# Altium project TP3_Ejercicio3.PrjPcb
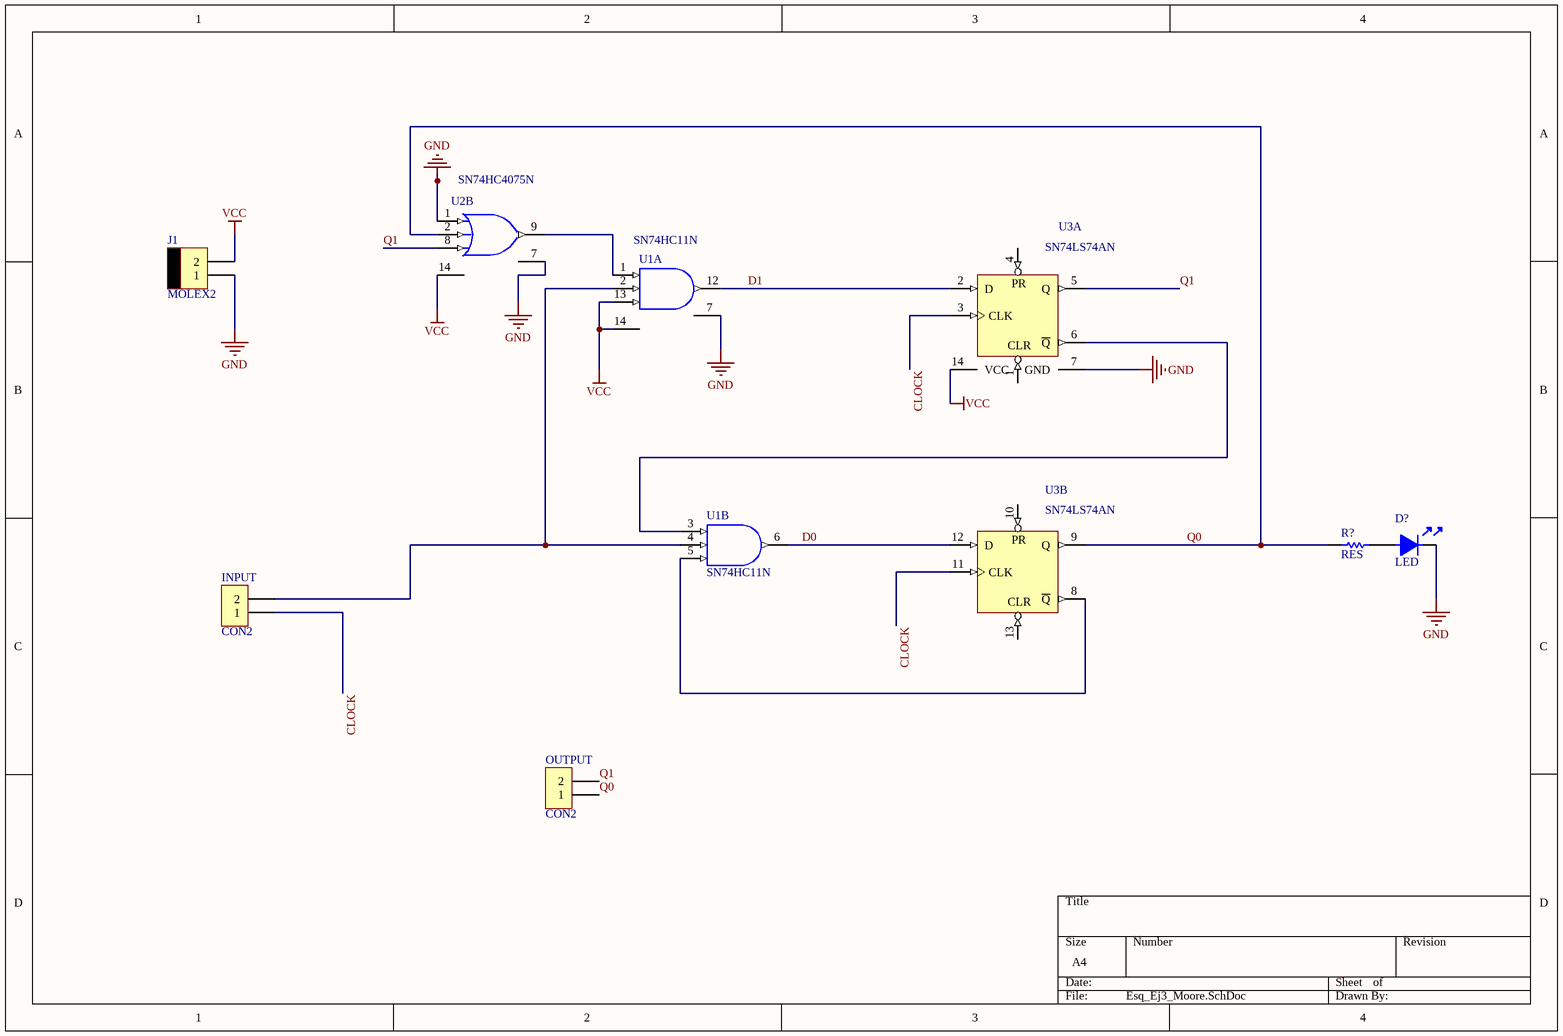
[diagram p0: Esq_Ej3_Moore.SchDoc]
2 sheets, 16 parts. Net scope: global (net labels, ports and power ports of the same name join across sheets).
Board file: PCB_Ej3.PcbDoc
Sheets:
  Esq_Ej3_Moore.SchDoc
  Esq_Ej3_Mealy.SchDoc

## Sheet Esq_Ej3_Moore.SchDoc
size A4

### Parts
(Parts that share a designator on the sheet are numbered #1, #2 ... from top to bottom, then left to right.)
D?#1  LED  [LED3]
INPUT#1  CON2  [SIP2]
J1  MOLEX2  [MOLEX2]
OUTPUT  CON2  [SIP2]
R?#1  RES  [RES400]
U1  SN74HC11N  [N014]  (parts A,B of 3)
U2  SN74HC4075N  [N014]  (part B of 3)
U3  SN74LS74AN  [N014D]  (parts A,B of 2)

### Nets
GND: D?#1.2 J1.1 U1.7(GND) U2.1(A) U2.7(GND) U3.7(GND)
VCC: J1.2 U1.13(C) U1.14(VCC) U2.14(VCC) U3.14(VCC)
CLOCK: INPUT#1.1 U3.3(CLK) U3.11(CLK)
D0: U1.6(Y) U3.12(D)
D1: U1.12(Y) U3.2(D)
Q0: OUTPUT.1 R?#1.1 U2.2(B) U3.9(Q)
Q1: OUTPUT.2 U2.8(C) U3.5(Q)
NetD?#1_1: D?#1.1 R?#1.2
NetINPUT#1_2: INPUT#1.2 U1.2(B) U1.4(B)
NetU1_1: U1.1(A) U2.9(Y)
NetU1_3: U1.3(A) U3.6(~{Q})
NetU1_5: U1.5(C) U3.8(~{Q})

Not connected (* = marked no-connect by the designer): U3 1(CLR) 4(PR) 10(PR) 13(CLR)

### Library data of the parts
U1 = SN74HC11N: Triple 3-Input Positive-AND Gate; Published: 8-Jun-2000; LatestRevisionDate: 04-Mar-2005; LatestRevisionNote: Stylized 3D Model Added.; DatasheetVersion: May-1997; PackageVersion: Oct-1995; PackageReference: N014; Publisher: Altium Limited; PackageDescription: DIP; 14 Leads; Row Spacing 7.62 mm; Pitch 2.54 mm; ComponentLink1Description: Manufacturer Link; ComponentLink1URL: http://www.ti.com/; ComponentLink2Description: Datasheet; ComponentLink2URL: http://www-s.ti.com/sc/ds/SN74HC11.pdf
U2 = SN74HC4075N: Triple 3-Input Positive-OR Gate; Published: 8-Jun-2000; LatestRevisionDate: 04-Mar-2005; LatestRevisionNote: Stylized 3D Model Added.; DatasheetVersion: Sep-1987; PackageVersion: Oct-1995; PackageReference: N014; Publisher: Altium Limited; PackageDescription: DIP; 14 Leads; Row Spacing 7.62 mm; Pitch 2.54 mm; ComponentLink1Description: Manufacturer Link; ComponentLink1URL: http://www.ti.com/; ComponentLink2Description: Datasheet; ComponentLink2URL: http://www-s.ti.com/sc/ds/sn74hc4075.pdf
U3 = SN74LS74AN: Dual D-Type Positive-Edge-Triggered Flip-Flop with Preset and Clear; Published: 8-Jun-2000; LatestRevisionDate: 04-Mar-2005; LatestRevisionNote: Stylized 3D Model Added.; DatasheetVersion: Mar-1988; PackageVersion: Oct-1995; PackageReference: N014D; Publisher: Altium Limited; PackageDescription: DIP; 14 Leads; Row Spacing 7.62 mm; Pitch 2.54 mm; ComponentLink1Description: Manufacturer Link; ComponentLink1URL: http://www.ti.com/; ComponentLink2Description: Datasheet; ComponentLink2URL: http://www-s.ti.com/sc/ds/sn74ls74a.pdf

## Sheet Esq_Ej3_Mealy.SchDoc
size A4
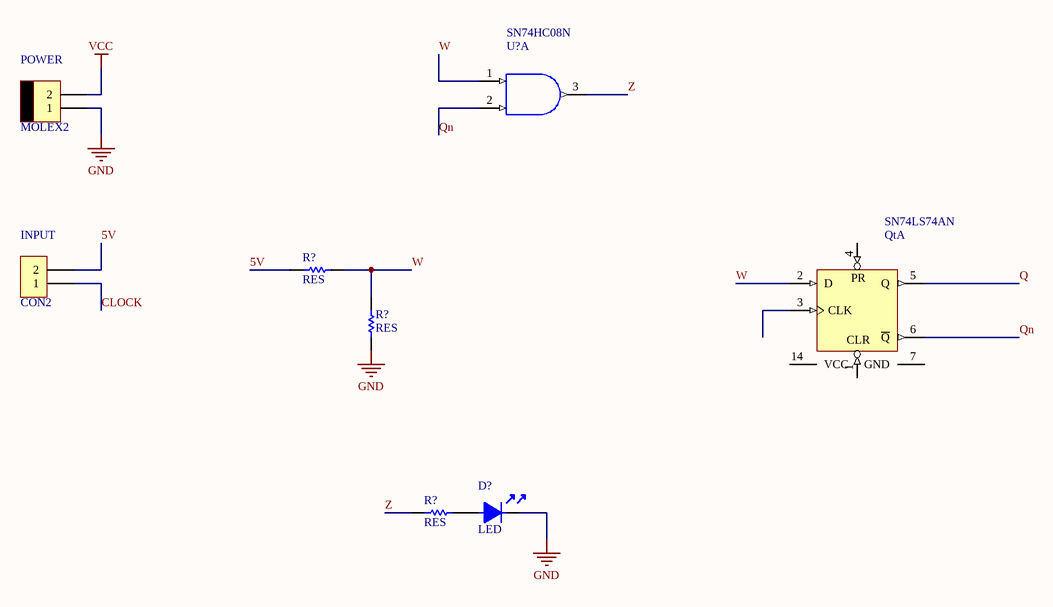
[diagram p1: Esq_Ej3_Mealy.SchDoc]

### Parts
(Parts that share a designator on the sheet are numbered #1, #2 ... from top to bottom, then left to right.)
D?#2  LED  [LED3]
INPUT#2  CON2  [SIP2]
POWER  MOLEX2  [MOLEX2]
Qt  SN74LS74AN  [N014D]  (part A of 2)
R?#2  RES  [RES400]
R?#3  RES  [RES400]
R?#4  RES  [RES400]
U?  SN74HC08N  [N014]  (part A of 4)

### Nets
GND: D?#2.2 POWER.1 R?#3.1 U?.7(GND)
VCC: POWER.2 U?.14(VCC)
5V: INPUT#2.2 R?#2.1
CLOCK: INPUT#2.1
Q: Qt.5(Q)
Qn: Qt.6(~{Q}) U?.2(B)
W: Qt.2(D) R?#2.2 R?#3.2 U?.1(A)
Z: R?#4.1 U?.3(Y)
NetD?#2_1: D?#2.1 R?#4.2

Not connected (* = marked no-connect by the designer): Qt 1(CLR) 3(CLK) 4(PR) 7(GND) 14(VCC)

### Library data of the parts
Qt = SN74LS74AN: as U3 on sheet Esq_Ej3_Moore; Published: 8-Jun-2000; LatestRevisionDate: 04-Mar-2005; LatestRevisionNote: Stylized 3D Model Added.; DatasheetVersion: Mar-1988; PackageVersion: Oct-1995; PackageReference: N014D; Publisher: Altium Limited; PackageDescription: DIP; 14 Leads; Row Spacing 7.62 mm; Pitch 2.54 mm; ComponentLink1Description: Manufacturer Link; ComponentLink1URL: http://www.ti.com/; ComponentLink2Description: Datasheet; ComponentLink2URL: http://www-s.ti.com/sc/ds/sn74ls74a.pdf
U? = SN74HC08N: Quadruple 2-Input Positive-AND Gate; Published: 8-Jun-2000; LatestRevisionDate: 04-Mar-2005; LatestRevisionNote: Stylized 3D Model Added.; DatasheetVersion: May-1997; PackageVersion: Oct-1995; PackageReference: N014; Publisher: Altium Limited; PackageDescription: DIP; 14 Leads; Row Spacing 7.62 mm; Pitch 2.54 mm; ComponentLink1Description: Manufacturer Link; ComponentLink1URL: http://www.ti.com/; ComponentLink2Description: Datasheet; ComponentLink2URL: http://www-s.ti.com/sc/ds/SN74HC08.pdf

## Nets that join several sheets
GND: Esq_Ej3_Moore (6 pins), Esq_Ej3_Mealy (D?#2.2 POWER.1 R?#3.1 U?.7)
VCC: Esq_Ej3_Moore (5 pins), Esq_Ej3_Mealy (POWER.2 U?.14)
CLOCK: Esq_Ej3_Moore (INPUT#1.1 U3.3 U3.11), Esq_Ej3_Mealy (INPUT#2.1)